# EAGLE design gps-breakout-mk-1.4.1 (EAGLE 9.3.1)
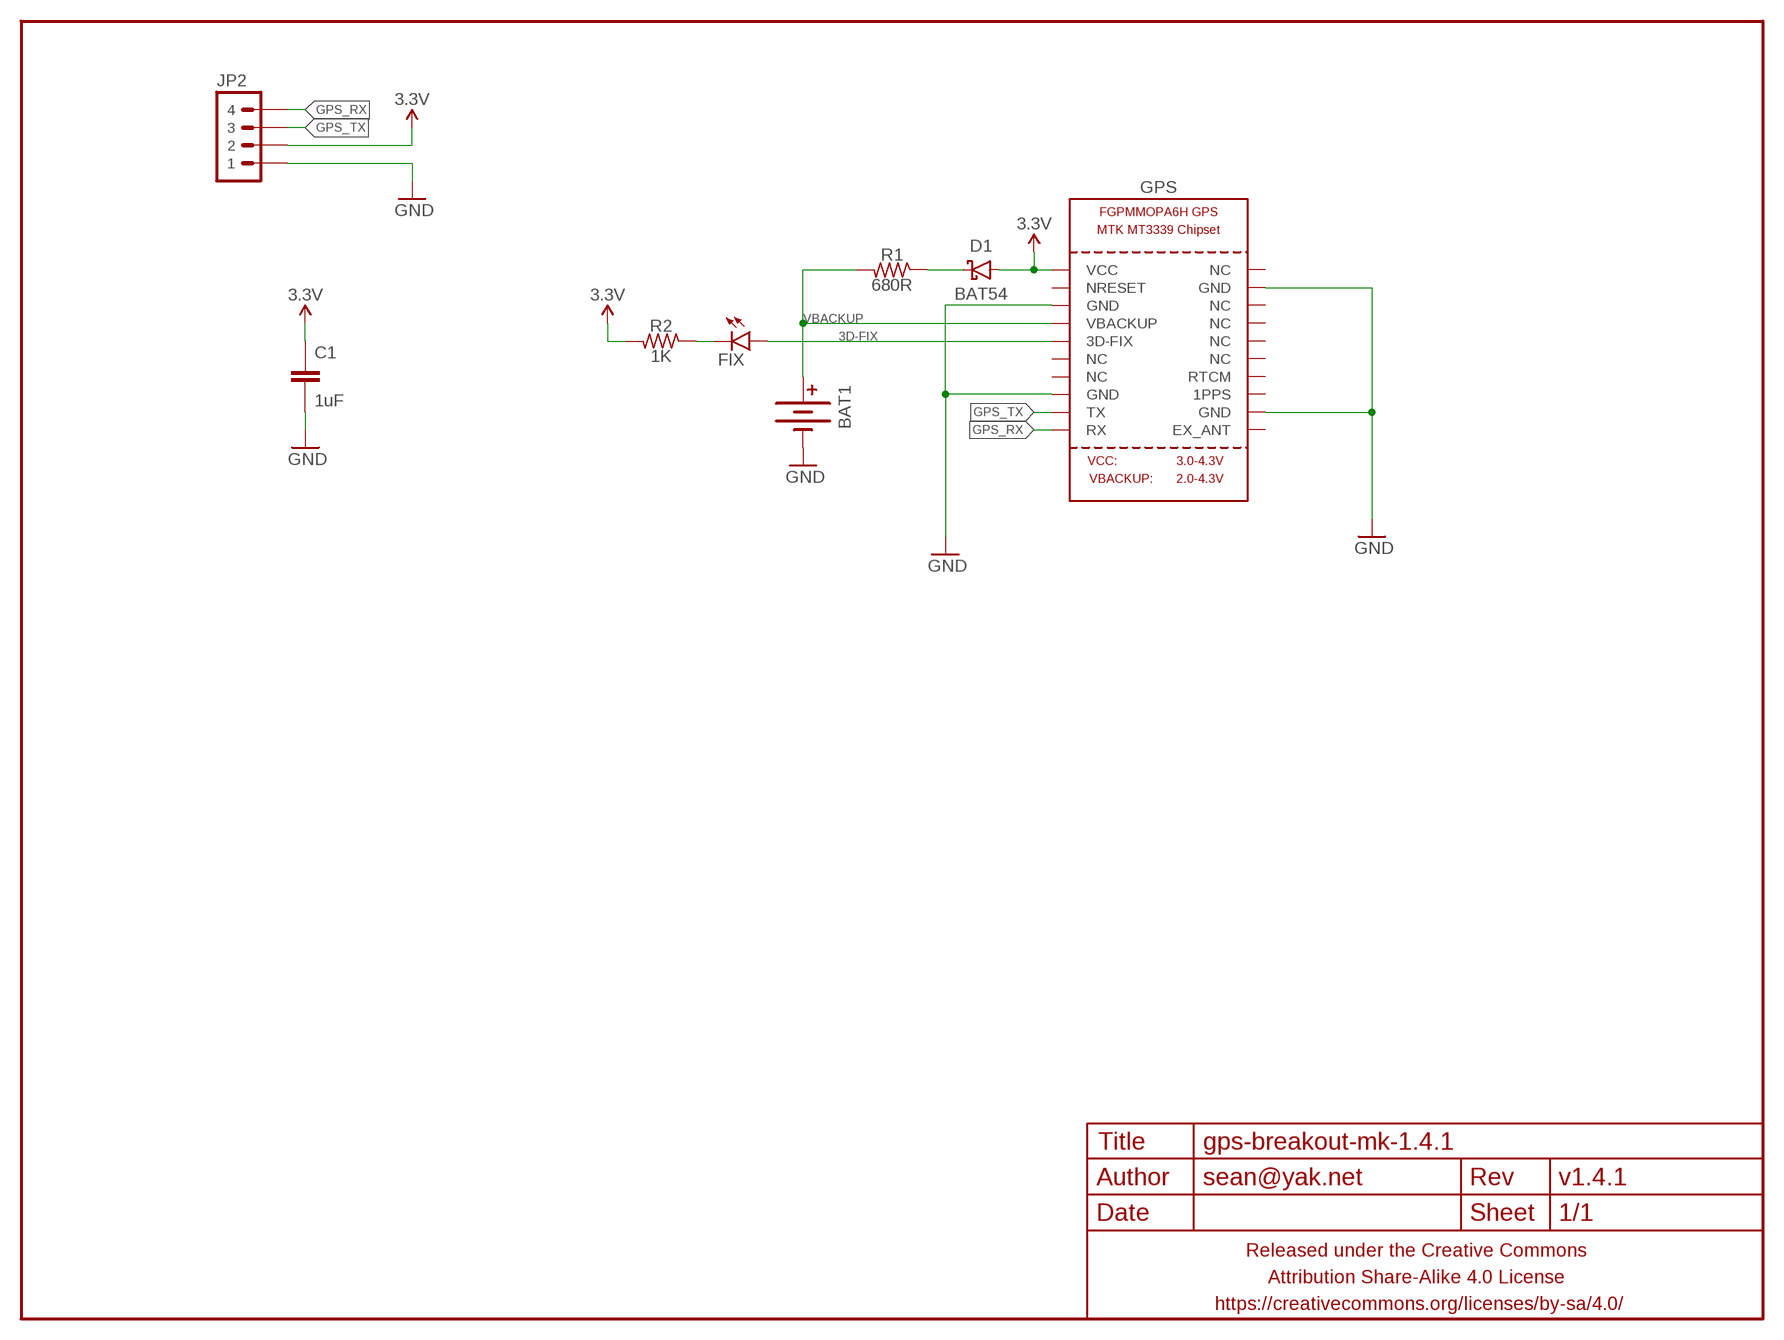
[diagram p0: schematic, sheet 1]

## Parts
BAT1  BATTERYML414  [BATTCON_4.8MM]
C1  1uF  CAPACITOR-CERAMICC0603-TIGHTER  [C0603-TIGHTER]
D1  BAT54  DIODE-SCHOTTKYSOD323  [SOD323-SCHOTTKY]
FIX  LED0603-TIGHT  [LED-0603-TIGHT]
FRAME1  FRAME-LETTERNO_PACKAGE  [DUMMY]
GPS  GPS_FGPMMOPA6H  [FGPMMOPA6H]
JP2  M04SMD-FEMALE-DUAL  [1X04-SMD-FEMALE-RA-DUAL]
R1  680R  RESISTORR0603-TIGHTER  [R0603-TIGHTER]
R2  1K  RESISTORR0603-TIGHTER  [R0603-TIGHTER]

## Nets
3.3V: C1.1 D1.A GPS.P$1(VCC) JP2.P$2 JP2.P$2_1 R2.2
3D-FIX: FIX.A GPS.P$5(3D-FIX)
GND: BAT1.- C1.2 GPS.P$3(GND) GPS.P$8(GND) GPS.P$12(GND) GPS.P$19(GND) JP2.P$1 JP2.P$1_1
GPS_RX: GPS.P$10(RX) JP2.P$4 JP2.P$4_1
GPS_TX: GPS.P$9(TX) JP2.P$3 JP2.P$3_1
N$1: D1.C R1.1
N$2: FIX.C R2.1
VBACKUP: BAT1.A1(+) BAT1.A2(+) GPS.P$4(VBACKUP) R1.2
Unconnected: GPS.P$2(NRESET) GPS.P$6(NC) GPS.P$7(NC) GPS.P$11(EX_ANT) GPS.P$13(1PPS) GPS.P$14(RTCM) GPS.P$15(NC) GPS.P$16(NC) GPS.P$17(NC) GPS.P$18(NC) GPS.P$20(NC)

## Library data of the parts
BAT1 = a_parts:BATTERY: Battery Holders Various common sizes : AA, AAA, 20mm coin cell and 12mm coin cell. 20MM_4LEGS, BATT-10373
C1 = a_parts:CAPACITOR-CERAMIC: CAPACITOR, European symbol
D1 = a_parts:DIODE-SCHOTTKY: Schottky diodes in SFE's production catalog BAT20J 1A 23V 0.62Vf RB751 120mA 40V 0.37Vf PMEG4005EJ 0.5A 40V 0.42Vf MBRA140 1A 40V 0.5Vf B340A 3A 40V SMA
FIX = a_parts:LED: LEDs Standard schematic elements and footprints for 5mm, 3mm, 1206, and 0603 sized LEDs. 5mm - Spark Fun Electronics SKU : COM-00529 (and others)
FRAME1 = a_parts:FRAME-LETTER: Schematic Frame Standard 8.5x11 US Letter frame; DESIGNER: sean@yak.net; VERSION: v1.4.1
GPS = a_parts:GPS_FGPMMOPA6H: GPS Module - MTK MT3339 Chipset, -165dBm sensitivity, 22 channels, 10Hz, auto-select external antenna options
JP2 = a_parts:M04: Header 4 Standard 4-pin 0.1" header. Use with straight break away headers (SKU : PRT-00116), right angle break away headers (PRT-00553), swiss pins (PRT-00743), machine pins (PRT-00117), and female headers (PRT-00115). Molex polarized connector foot print use with SKU : PRT-08231 with associated crimp pins and housings. 1MM SMD Version SKU: PRT-10208
R1 R2 = a_parts:RESISTOR: RESISTOR, American symbol

## Board
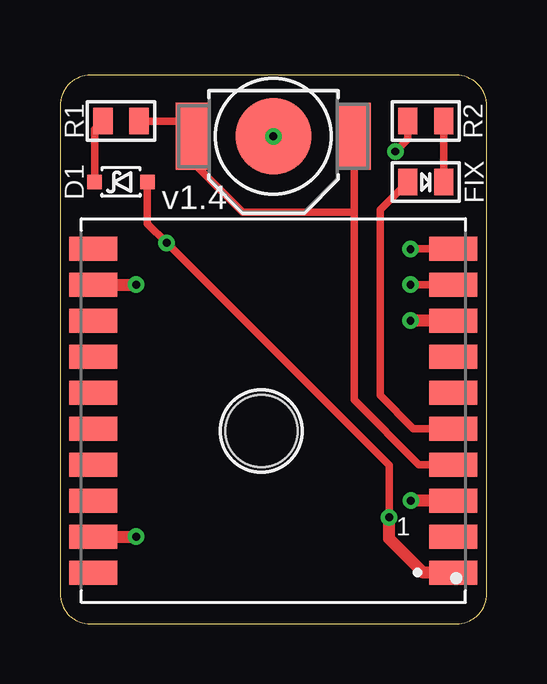
[diagram p1: board, top side]
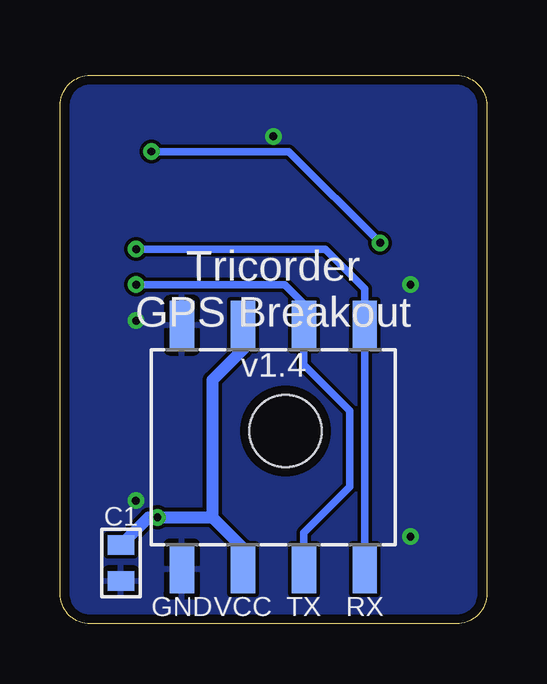
[diagram p2: board, bottom side, seen from below]

Size 17.78 x 22.86 mm. Coordinates in mm from the lower left corner, seen from the top.
Outline: 0,21.59 0,1.27 arc90 1.27,0 16.51,0 arc90 17.78,1.27 17.78,21.59 arc90 16.51,22.86 1.27,22.86 arc90 0,21.59
Copper layers (1*16): Top 0.0356mm / dielectric 1.5011mm / Bottom 0.0356mm
Design rules "LaenPCBOrder2 *": minimum track width 6mil, minimum drill 13mil, track to track 6mil, track to pad 6mil, pad to pad 6mil, via to via 6mil, smd to smd 6mil, copper to edge 15mil, drill to drill 6mil, minimum pad ring 7mil, minimum via ring 7mil, stop-mask expansion 3mil, vias tented up to drill 20mil, thermal gap 10mil

### Footprints (pad centres in the part's own frame; a part is rotated, then mirrored left to right if it is on the bottom)
BATTCON_4.8MM = smd 3.18 x 3.18: - 0,0 | smd 1.4 x 2.8: A1 -3.365,0; A2 3.365,0
C0603-TIGHTER = smd 0.8 x 1.1: 1 -0.75,0; 2 0.75,0
SOD323-SCHOTTKY = smd 0.6 x 0.6: A -1.1,0; C 1.1,0
LED-0603-TIGHT = smd 0.8 x 1.1: A 0.75,0; C -0.75,0
FGPMMOPA6H = smd 2 x 1: P$1 -7.5,6.75; P$2 -7.5,5.25; P$3 -7.5,3.75; P$4 -7.5,2.25; P$5 -7.5,0.75; P$6 -7.5,-0.75; P$7 -7.5,-2.25; P$8 -7.5,-3.75; P$9 -7.5,-5.25; P$10 -7.5,-6.75; P$11 7.5,-6.75; P$12 7.5,-5.25; P$13 7.5,-3.75; P$14 7.5,-2.25; P$15 7.5,-0.75; P$16 7.5,0.75; P$17 7.5,2.25; P$18 7.5,3.75; P$19 7.5,5.25; P$20 7.5,6.75 | hole 3: 0.5,0.85
1X04-SMD-FEMALE-RA-DUAL = smd 1.016 x 2.032: P$1 -3.81,5.08; P$1_1 -3.81,-5.08; P$2 -1.27,5.08; P$2_1 -1.27,-5.08; P$3 1.27,5.08; P$3_1 1.27,-5.08; P$4 3.81,5.08; P$4_1 3.81,-5.08
R0603-TIGHTER = smd 0.8 x 1.1: 1 -0.75,0; 2 0.75,0

### Placement (x,y rotation side)
BAT1  8.89,20.32 0 top
C1  15.24,2.54 270 bottom
D1  2.54,18.41 180 top
FIX  15.24,18.41 180 top
FRAME1  0,0 0 top
GPS  8.89,8.89 180 top
JP2  8.89,7.37 0 bottom
R1  2.54,20.95 0 top
R2  15.24,20.95 180 top

### Tracks (layer width: path | path; a pad name or v marks a point on that pad's centre or on a via)
3.3V  (via drill 0.33)
  Top 0.305: v13.72,4.45 13.72,6.6 v4.45,15.88 3.64,16.68 D1.A | R2.2 14.49,20.2 v13.97,19.68
  Top 0.508: GPS.P$1 15.13,2.14 13.72,3.56 v13.72,4.45
  Bottom 0.305: v13.97,19.68 8.26,19.68 v4.45,15.88
  Bottom 0.508: 11.43,4.45 v13.72,4.45 14.09,4.45 C1.1 | 11.43,4.45 10.16,3.17 JP2.P$2_1 | JP2.P$2 10.16,11.43 11.43,10.16 11.43,4.45
3D-FIX
  Top 0.305: FIX.A 13.34,17.26 13.34,9.53 14.72,8.14 GPS.P$5
GND  (via drill 0.33)
  Top 0.508: GPS.P$8 v14.61,12.64 | GPS.P$19 v3.17,3.64 | GPS.P$12 v3.17,14.14 | GPS.P$3 v14.62,5.14
  other vias: 8.89,20.32
  pour Bottom: 0,22.86 17.78,22.86 17.78,0 0,0
GPS_RX  (via drill 0.33)
  Top 0.305: GPS.P$10 14.62,15.64 v14.61,15.62
  Bottom 0.305: v14.61,15.62 6.73,15.62 5.08,13.97 JP2.P$4 JP2.P$4_1
GPS_TX  (via drill 0.33)
  Top 0.305: GPS.P$9 v14.61,14.14
  Bottom 0.305: v14.61,14.14 8.43,14.14 7.62,13.34 JP2.P$3 7.62,10.79 5.71,8.89 5.71,5.71 7.62,3.81 JP2.P$3_1
N$1
  Top 0.305: D1.C 1.44,20.61 R1.1
N$2
  Top 0.305: R2.1 FIX.C
VBACKUP
  Top 0.305: BAT1.A2 12.26,17.14 | 12.26,17.14 12.26,9.34 14.95,6.64 GPS.P$4 | 12.26,17.14 7.62,17.14 5.53,19.24 BAT1.A1 4.89,20.95 R1.2

### Text on the board
tPlace: 1
bPlace: Tricorder / GPS Breakout
bNames: RX | TX | VCC | GND